# EAGLE design sequencer (EAGLE 9.6.2)
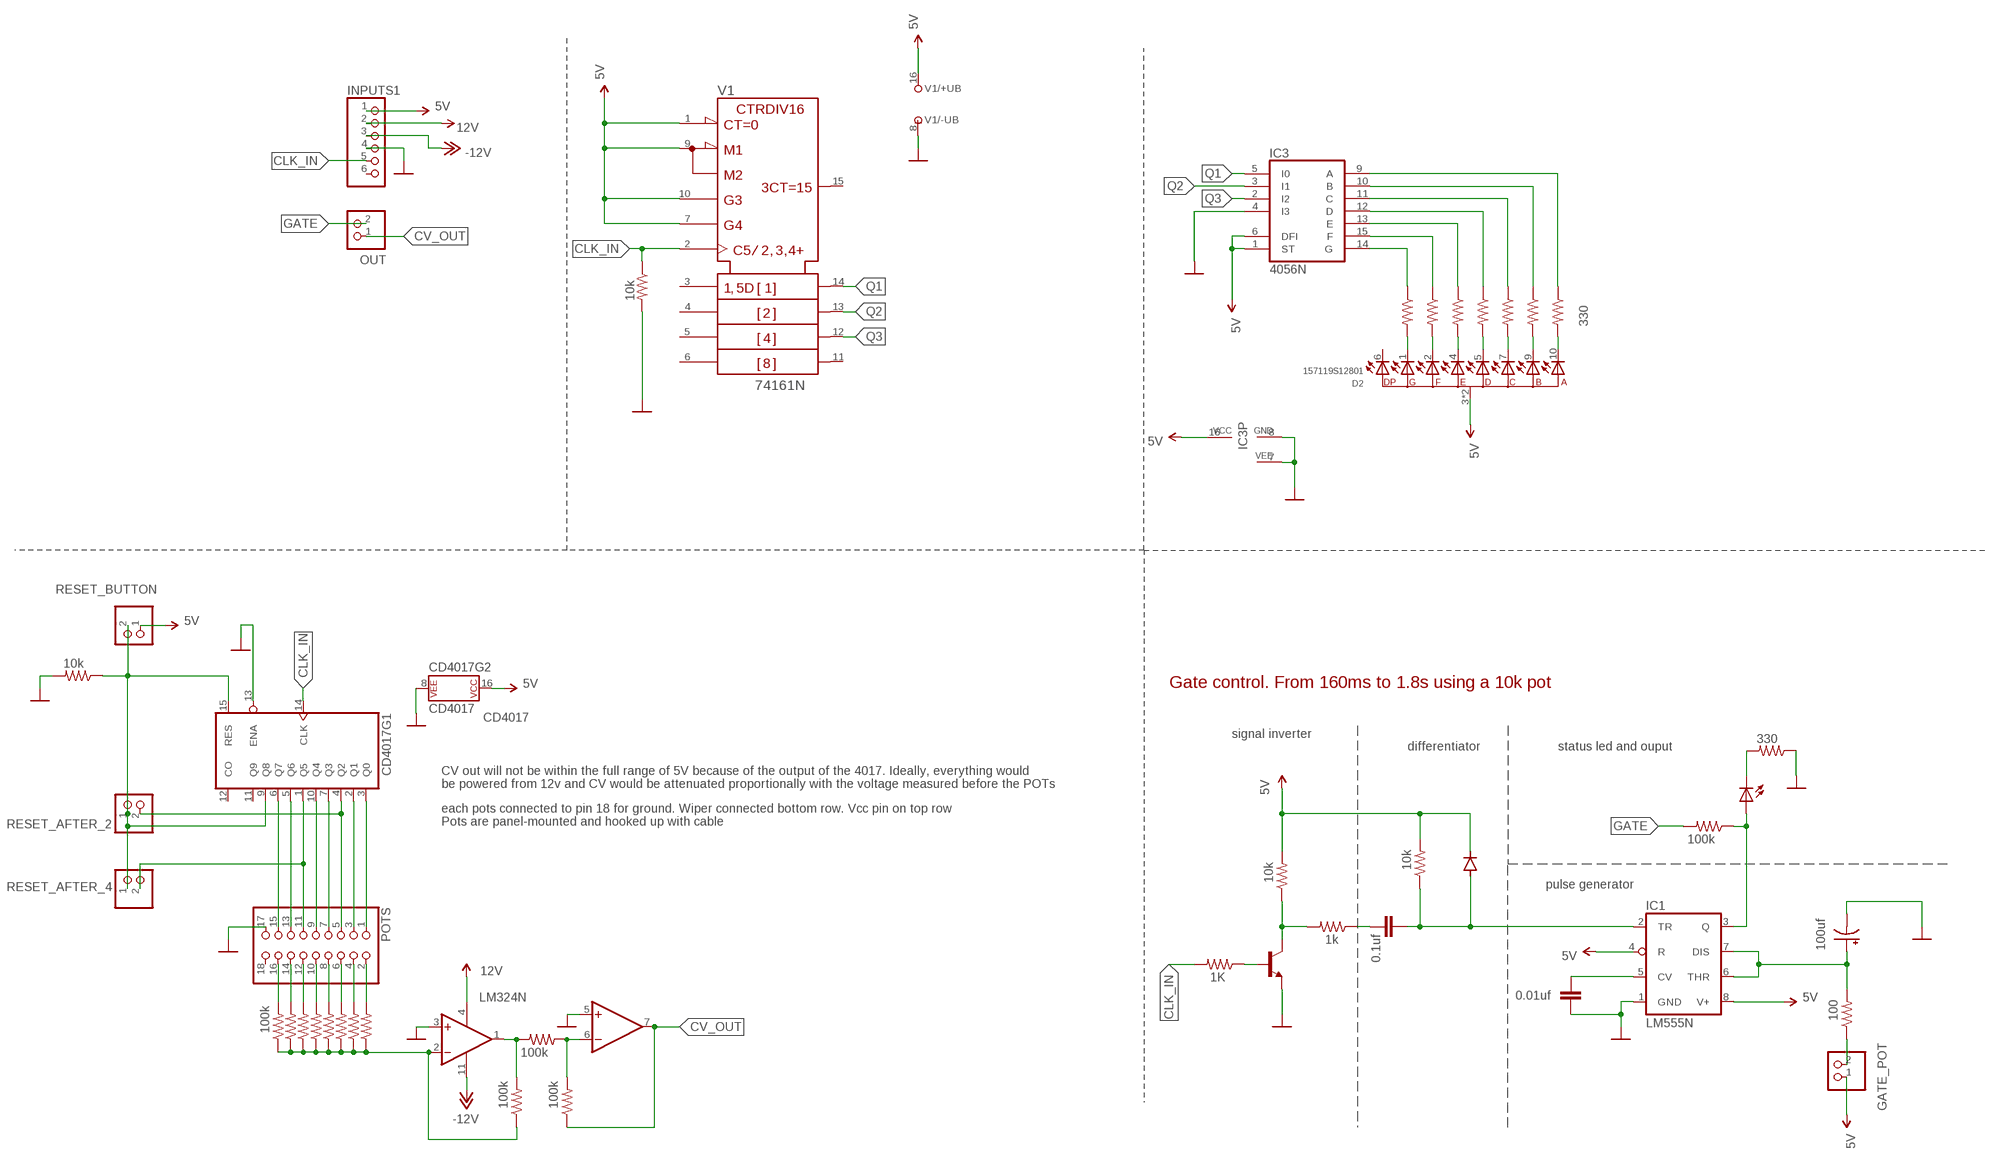
[diagram p0: schematic, sheet 1]

## Parts
1K1  100k  R-US_0207/12  [0207/12]
1K3  1k  R-US_0207/12  [0207/12]
1K4  10k  R-US_0207/12  [0207/12]
2N2  2N4401-NPN-TO92-EBC  [TO92-EBC]
C1  0.01uf  C-EU025-024X044  [C025-024X044]
C3  100uf  CPOL-USE2,5-6E  [E2,5-6E]
C4  0.1uf  C-EU025-024X044  [C025-024X044]
CD4017  CD4017  [DIP16]
D1  1N4004  [DO41-10]
D2  157119S12801  WL-T7DS_0.39INCH_COMMON-ANODE_157119S12801  [WL-T7DS_0.39INCH]
GATE_POT  PINHD-1X2  [1X02]
IC1  LM555N  [DIL08-ROUND]
IC2  LM324N  [DIL14]
IC3  4056N  [DIL16]
INPUTS1  PINHD-1X6  [1X06]
LED9  LED5MM  [LED5MM]
OUT  PINHD-1X2  [1X02]
POTS  PINHD-2X9  [2X09]
R1  330  R-US_0207/12  [0207/12]
R2  100k  R-US_0207/12  [0207/12]
R3  100k  R-US_0207/12  [0207/12]
R4  100k  R-US_0207/12  [0207/12]
R5  100k  R-US_0207/12  [0207/12]
R6  100k  R-US_0207/12  [0207/12]
R7  100k  R-US_0207/12  [0207/12]
R8  100k  R-US_0207/12  [0207/12]
R9  100k  R-US_0207/12  [0207/12]
R10  100k  R-US_0207/12  [0207/12]
R11  100k  R-US_0207/12  [0207/12]
R12  100k  R-US_0207/12  [0207/12]
R13  330  R-US_0207/12  [0207/12]
R14  330  R-US_0207/12  [0207/12]
R15  330  R-US_0207/12  [0207/12]
R16  330  R-US_0207/12  [0207/12]
R17  330  R-US_0207/12  [0207/12]
R18  330  R-US_0207/12  [0207/12]
R19  1K  R-US_0207/12  [0207/12]
R20  10k  R-US_0207/12  [0207/12]
R21  100  R-US_0207/12  [0207/12]
R22  10k  R-US_0207/12  [0207/12]
R23  330  R-US_0207/12  [0207/12]
R24  10k  R-US_0207/12  [0207/12]
RESET_AFTER_2  PINHD-1X2  [1X02]
RESET_AFTER_4  PINHD-1X2  [1X02]
RESET_BUTTON  PINHD-1X2  [1X02]
V1  74161N  [DIL16]

## Nets
5V: 1K4.2 CD4017.16(P$V+) D1.C D2.3(+) D2.8(+) GATE_POT.1 IC1.4(R) IC1.8(V+) IC3.1(ST) IC3.6(DFI) IC3.16(VCC) INPUTS1.1 R20.2 RESET_BUTTON.1 V1.1(!CLR) V1.7(ENP) V1.9(!LOAD) V1.10(ENT) V1.16(+UB)
12V: IC2.4(P:V+) INPUTS1.2
-12V: IC2.11(P:V-) INPUTS1.3
CLK_IN: CD4017.14(CLK) INPUTS1.5 R19.2 R24.1 V1.2(CLK)
CV_OUT: IC2.7(B:OUT) OUT.1 R11.1
GATE: 1K1.2 OUT.2
GND: 2N2.E C1.2 C3.- CD4017.8(P$V-) CD4017.13(ENA) IC1.1(GND) IC2.3(A:+IN) IC2.5(B:+IN) IC3.4(I3) IC3.7(VEE) IC3.8(GND) INPUTS1.4 POTS.17 R22.2 R23.1 R24.2 V1.8(-UB)
N$1: CD4017.9(Q8) CD4017.15(RES) R22.1 RESET_AFTER_2.1 RESET_AFTER_4.1 RESET_BUTTON.2
N$2: 1K3.1 C4.2
N$3: CD4017.3(Q0) POTS.1
N$4: CD4017.2(Q1) POTS.3
N$5: CD4017.4(Q2) POTS.5 RESET_AFTER_2.2
N$6: CD4017.7(Q3) POTS.7
N$7: CD4017.10(Q4) POTS.9
N$8: CD4017.1(Q5) POTS.11 RESET_AFTER_4.2
N$9: CD4017.5(Q6) POTS.13
N$10: CD4017.6(Q7) POTS.15
N$11: POTS.2 R3.2
N$12: POTS.4 R9.2
N$13: POTS.6 R8.2
N$14: POTS.8 R7.2
N$15: POTS.10 R6.2
N$16: POTS.12 R5.2
N$17: POTS.14 R4.2
N$18: POTS.16 R2.2
N$19: IC2.2(A:-IN) R2.1 R3.1 R4.1 R5.1 R6.1 R7.1 R8.1 R9.1 R10.1
N$20: IC2.1(A:OUT) R10.2 R12.2
N$21: IC2.6(B:-IN) R11.2 R12.1
N$22: IC3.15(F) R17.1
N$23: D2.1 R18.2
N$24: D2.2 R17.2
N$25: D2.4 R16.2
N$26: D2.5 R15.2
N$27: D2.7 R14.2
N$28: D2.9 R13.2
N$29: D2.10 R1.2
N$30: LED9.K(C) R23.2
N$31: GATE_POT.2 R21.1
N$32: 1K3.2 1K4.1 2N2.C
N$33: C4.1 D1.A IC1.2(TR) R20.1
N$34: C1.1 IC1.5(CV)
N$35: C3.+ IC1.6(THR) IC1.7(DIS) R21.2
N$36: 1K1.1 IC1.3(Q) LED9.A
N$37: IC3.9(A) R1.1
N$38: IC3.10(B) R13.1
N$39: IC3.11(C) R14.1
N$40: IC3.12(D) R15.1
N$41: IC3.13(E) R16.1
N$42: IC3.14(G) R18.1
N$43: 2N2.B R19.1
Q1: IC3.5(I0) V1.14(QA)
Q2: IC3.3(I1) V1.13(QB)
Q3: IC3.2(I2) V1.12(QC)
Unconnected: CD4017.11(Q9) CD4017.12(CO) D2.6 IC2.8(C:OUT) IC2.9(C:-IN) IC2.10(C:+IN) IC2.12(D:+IN) IC2.13(D:-IN) IC2.14(D:OUT) INPUTS1.6 POTS.18 V1.3(A) V1.4(B) V1.5(C) V1.6(D) V1.11(QD) V1.15(RCO)

## Notes on the sheet
- Gate control. From 160ms to 1.8s using a 10k pot
- signal inverter
- differentiator | status led and ouput
- CV out will not be within the full range of 5V because of the output of the 4017. Ideally, everything would 
  be powered from 12v and CV would be attenuated proportionally with the voltage measured before the POTs
- each pots connected to pin 18 for ground. Wiper connected bottom row. Vcc pin on top row
  Pots are panel-mounted and hooked up with cable
- pulse generator

## Library data of the parts
1K1 1K3 1K4 R1-R24 = adafruit:R-US_: RESISTOR, American symbol
2N2 = transistor-neu-to92:*-NPN-: NPN Transistror
C1 C4 = rcl:C-EU: CAPACITOR, European symbol; SPICEPREFIX: C
C3 = rcl:CPOL-US: POLARIZED CAPACITOR, American symbol; SPICEPREFIX: C
CD4017 = SparkFun-IC-Logic:CD4017: 10-Out Decade Counter Datasheet <https://cdn.sparkfun.com/datasheets/Kits/cd4022b.pdf> SparkFun Products SparkFun SparkPunk Sequencer Kit <https://www.sparkfun.com/products/12707> (KIT-12707); PROD_ID: IC-11929
D1 = diode:1N4004: DIODE general purpose rectifier, 1 A
D2 = Wurth_7 Segments Display_WL-T7DS:WL-T7DS_0.39INCH_COMMON-ANODE: WL-T7DS 7 Segments Display THT Single Digit Characteristics Industrial standard size and schematic Low power consumption Grey surface Milky / Diffuesed segments Driving with DC current in forward direction only Suitable for high peak current upto 100 mA Applications Audio / measure equipment Instrument panels Digital read out display Control units <https://www.we-online.com/catalog/media/o447285v209%20WL_T7DS_Group.jpg> Details see: https://www.we-online.com/catalog/en/WL-T7DS Created by Ella Wu, 2021-05-31 2021 (C) Wurth Elektronik; DATASHEET-URL: https://www.we-online.com/catalog/datasheet/157119S12801.pdf; EMITTING-COLOR: Super Red; HEIGHT: 7mm; IV-TYP: 38mcd; LENGTH: 13mm; PART-NUMBER: 157119S12801; VF-TYP: 2V; WIDTH: 10mm
GATE_POT OUT RESET_AFTER_2 RESET_AFTER_4 RESET_BUTTON = pinhead:PINHD-1X2: PIN HEADER
IC1 = adafruit:*555: TIMER Changed DIP package to have round (not oval) pin pads http://www.ladyada.net/library/pcb/eaglelibrary.html
IC2 = linear:LM324: OP AMP
IC3 = 40xx:4056: BCD to 7-segment LCD DECODER/DRIVER
INPUTS1 = pinhead:PINHD-1X6: PIN HEADER
LED9 = adafruit:LED: LED OSRAM: - CHIPLED LG R971, LG N971, LY N971, LG Q971, LY Q971, LO R971, LY R971 LH N974, LH R974 LS Q976, LO Q976, LY Q976 LO Q996 - Hyper CHIPLED LW Q18S LB Q993, LB Q99A, LB R99A - SideLED LS A670, LO A670, LY A670, LG A670, LP A670 LB A673, LV A673, LT A673, LW A673 LH A674 LY A675 LS A676, LA A676, LO A676, LY A676, LW A676 LS A679, LY A679, LG A679 - Hyper Micro SIDELED® LS Y876, LA Y876, LO Y876, LY Y876 LT Y87S - SmartLED LW L88C, LW L88S LB L89C, LB L89S, LG L890 LS L89K, LO L89K, LY L89K LS L896, LA L896, LO L896, LY L896 - TOPLED LS T670, LO T670, LY T670, LG T670, LP T670 LSG T670, LSP T670, LSY T670, LOP T670, LYG T670 LG T671, LOG T671, LSG T671 LB T673, LV T673, LT T673, LW T673 LH T674 LS T676, LA T676, LO T676, LY T676, LB T676, LH T676, LSB T676, LW T676 LB T67C, LV T67C, LT T67C, LS T67K, LO T67K, LY T67K, LW E67C LS E67B, LA E67B, LO E67B, LY E67B, LB E67C, LV E67C, LT E67C LW T67C LS T679, LY T679, LG T679 LS T770, LO T770, LY T770, LG T770, LP T770 LB T773, LV T773, LT T773, LW T773 LH T774 LS E675, LA E675, LY E675, LS T675 LS T776, LA T776, LO T776, LY T776, LB T776 LHGB T686 LT T68C, LB T68C - Hyper Mini TOPLED® LB M676 - Mini TOPLED Santana® LG M470 LS M47K, LO M47K, LY M47K Source: http://www.osram.convergy.de/
POTS = pinhead:PINHD-2X9: PIN HEADER
V1 = 74ttl-din:74*161: Synchrounus 4-bit COUNTER

## Board
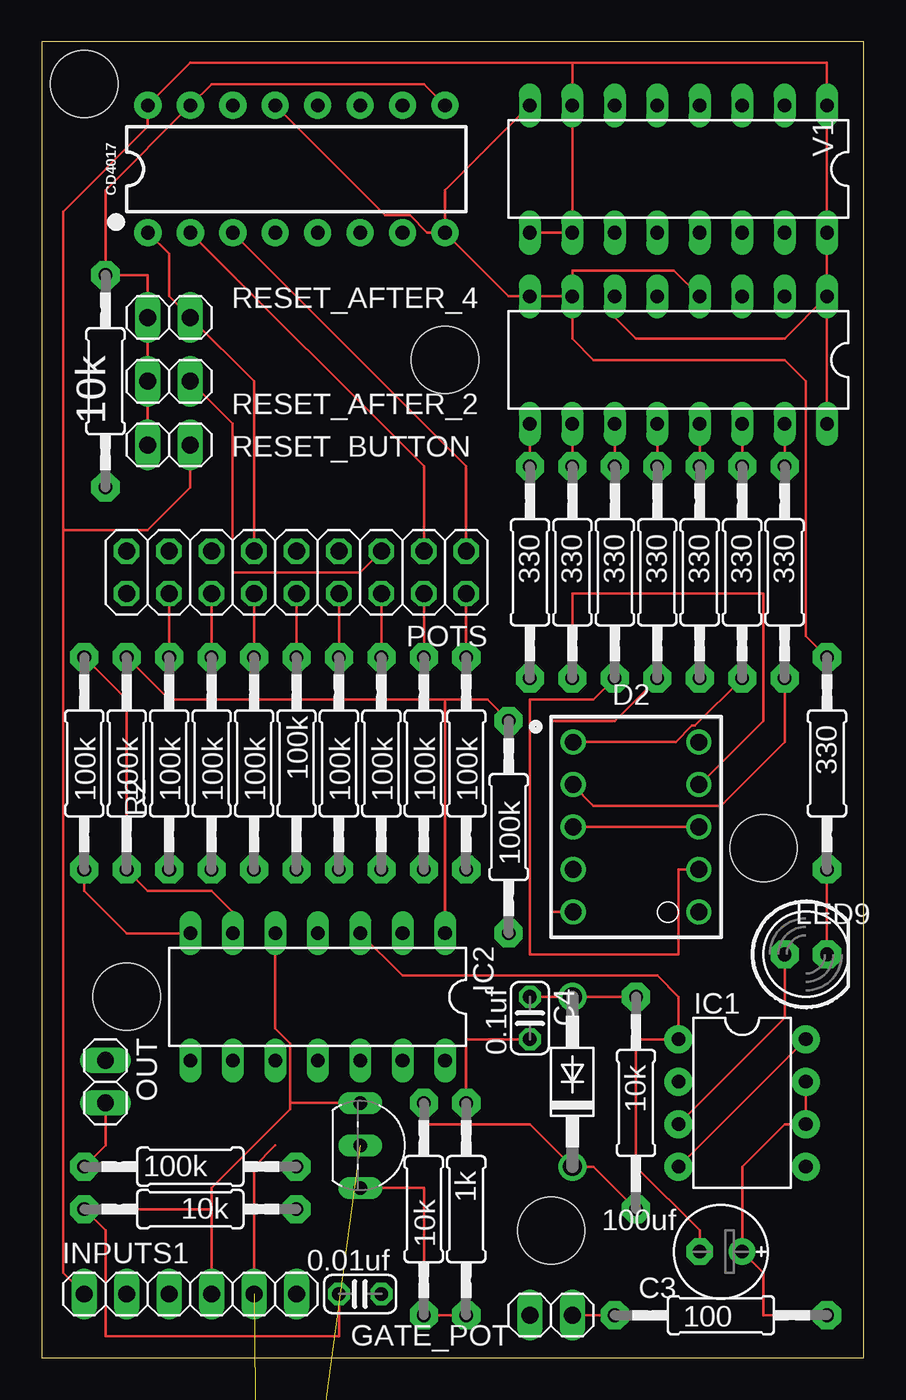
[diagram p1: board, top side]
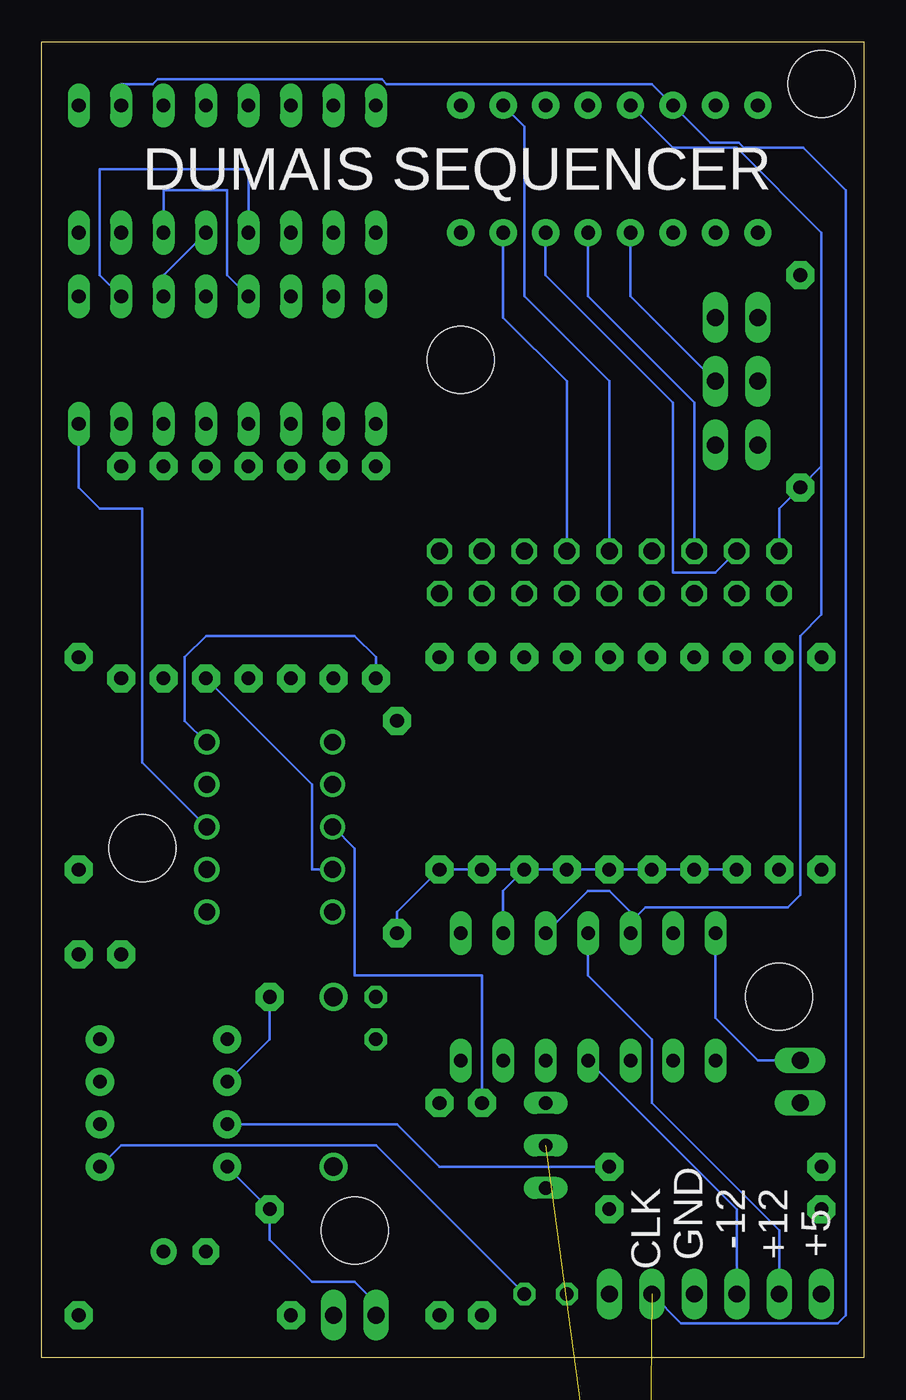
[diagram p2: board, bottom side, seen from below]

Size 49.2 x 78.73 mm. Coordinates in mm from the lower left corner, seen from the top.
Outline: 0,0 49.2,0 49.2,78.73 0,78.73 0,0
Copper layers (1*16): Top 0.035mm / dielectric 1.5mm / Bottom 0.035mm
Design rules "default": minimum track width 6mil, minimum drill 0.35mm, track to track 6mil, track to pad 6mil, pad to pad 6mil, via to via 6mil, smd to smd 6mil, copper to edge 40mil, drill to drill 6mil, minimum pad ring 10mil, minimum via ring 8mil, stop-mask expansion 4mil, vias tented up to drill 0mil, thermal gap 10mil
Holes 4 mm at 2.54,76.2 24.13,59.69 5.08,21.59 43.18,30.48 30.48,7.62

### Footprints (pad centres in the part's own frame; a part is rotated, then mirrored left to right if it is on the bottom)
0207/12 = drill 0.813 pad 1.676 octagon: 1 -6.35,0; 2 6.35,0
TO92-EBC = drill 0.813 long: B 0,-1.27; C 2.54,-1.27; E -2.54,-1.27
C025-024X044 = drill 0.813 octagon: 1 -1.27,0; 2 1.27,0
E2,5-6E = drill 0.813 pad 1.575: + -1.27,0 | drill 0.813 pad 1.575 octagon: - 1.27,0
DIP16 = drill 0.813 pad 1.626: 1 -8.89,-3.81; 2 -6.35,-3.81; 3 -3.81,-3.81; 4 -1.27,-3.81; 5 1.27,-3.81; 6 3.81,-3.81; 7 6.35,-3.81; 8 8.89,-3.81; 9 8.89,3.81; 10 6.35,3.81; 11 3.81,3.81; 12 1.27,3.81; 13 -1.27,3.81; 14 -3.81,3.81; 15 -6.35,3.81; 16 -8.89,3.81
DO41-10 = drill 1.118: A 5.08,0; C -5.08,0
WL-T7DS_0.39INCH = drill 1: 1 -3.76,5.08; 2 -3.76,2.54; 3 -3.76,0; 4 -3.76,-2.54; 5 -3.76,-5.08; 6 3.76,-5.08; 7 3.76,-2.54; 8 3.76,0; 9 3.76,2.54; 10 3.76,5.08
1X02 = drill 1.016 long: 1 -1.27,0; 2 1.27,0
DIL08-ROUND = drill 0.813 pad 1.676: 1 -3.81,-3.81; 2 -1.27,-3.81; 3 1.27,-3.81; 4 3.81,-3.81; 5 3.81,3.81; 6 1.27,3.81; 7 -1.27,3.81; 8 -3.81,3.81
DIL14 = drill 0.813 long: 1 -7.62,-3.81; 2 -5.08,-3.81; 3 -2.54,-3.81; 4 0,-3.81; 5 2.54,-3.81; 6 5.08,-3.81; 7 7.62,-3.81; 8 7.62,3.81; 9 5.08,3.81; 10 2.54,3.81; 11 0,3.81; 12 -2.54,3.81; 13 -5.08,3.81; 14 -7.62,3.81
DIL16 = drill 0.813 long: 1 -8.89,-3.81; 2 -6.35,-3.81; 3 -3.81,-3.81; 4 -1.27,-3.81; 5 1.27,-3.81; 6 3.81,-3.81; 7 6.35,-3.81; 8 8.89,-3.81; 9 8.89,3.81; 10 6.35,3.81; 11 3.81,3.81; 12 1.27,3.81; 13 -1.27,3.81; 14 -3.81,3.81; 15 -6.35,3.81; 16 -8.89,3.81
1X06 = drill 1.016 long: 1 -6.35,0; 2 -3.81,0; 3 -1.27,0; 4 1.27,0; 5 3.81,0; 6 6.35,0
LED5MM = drill 0.813 pad 1.676 octagon: A -1.27,0; K 1.27,0
2X09 = drill 1.016 octagon: 1 -10.16,-1.27; 2 -10.16,1.27; 3 -7.62,-1.27; 4 -7.62,1.27; 5 -5.08,-1.27; 6 -5.08,1.27; 7 -2.54,-1.27; 8 -2.54,1.27; 9 0,-1.27; 10 0,1.27; 11 2.54,-1.27; 12 2.54,1.27; 13 5.08,-1.27; 14 5.08,1.27; 15 7.62,-1.27; 16 7.62,1.27; 17 10.16,-1.27; 18 10.16,1.27

### Placement (x,y rotation side)
1K1  8.89,11.43 180 top
1K3  25.4,8.89 270 top
1K4  22.86,8.89 90 top
2N2  20.32,12.7 270 top
C1  19.05,3.81 180 top
C3  40.64,6.35 180 top
C4  29.21,20.32 270 top
CD4017  15.24,71.12 0 top
D1  31.75,16.51 90 top
D2  35.56,31.75 0 top
GATE_POT  30.48,2.54 0 top
IC1  41.91,15.24 270 top
IC2  16.51,21.59 180 top
IC3  38.1,59.69 180 top
INPUTS1  8.89,3.81 0 top
LED9  45.72,24.13 0 top
OUT  3.81,16.51 270 top
POTS  15.24,46.99 180 top
R1  29.21,46.99 270 top
R2  7.62,35.56 90 top
R3  25.4,35.56 90 top
R4  10.16,35.56 90 top
R5  12.7,35.56 90 top
R6  15.24,35.56 90 top
R7  17.78,35.56 90 top
R8  20.32,35.56 90 top
R9  22.86,35.56 90 top
R10  27.94,31.75 90 top
R11  2.54,35.56 90 top
R12  5.08,35.56 90 top
R13  31.75,46.99 270 top
R14  34.29,46.99 270 top
R15  36.83,46.99 270 top
R16  39.37,46.99 270 top
R17  44.45,46.99 270 top
R18  41.91,46.99 270 top
R19  7.62,-119.38 0 top  (outside the outline)
R20  35.56,15.24 270 top
R21  40.64,2.54 0 top
R22  3.81,58.42 270 top
R23  46.99,35.56 270 top
R24  8.89,8.89 180 top
RESET_AFTER_2  7.62,58.42 0 top
RESET_AFTER_4  7.62,62.23 0 top
RESET_BUTTON  7.62,54.61 180 top
V1  38.1,71.12 180 top

### Tracks (layer width: path | path; a pad name or v marks a point on that pad's centre or on a via)
5V
  Top 0.152: INPUTS1.1 1.27,5.08 1.27,49.53 | 1.27,49.53 1.27,68.58 6.35,73.66 CD4017.16 8.89,77.47 31.75,77.47 | V1.9 V1.10 V1.7 31.75,77.47 | 31.75,77.47 46.99,77.47 V1.1 V1.16 IC3.1 | D2.3 D2.8 | IC3.1 44.45,60.96 35.56,60.96 34.29,62.23 IC3.6 | IC3.1 IC3.16 | 1K4.2 22.86,13.97 29.21,13.97 D1.C 33.02,11.43 R20.2 | IC1.8 IC1.4 | RESET_BUTTON.1 8.89,52.07 6.35,49.53 1.27,49.53
  Bottom 0.152: 1K4.2 22.86,22.86 30.48,22.86 30.48,30.48 31.75,31.75 D2.3 | D2.8 43.18,35.61 43.18,50.8 45.72,50.8 46.99,52.07 IC3.16 | GATE_POT.1 29.21,3.26 30.48,4.53 33.03,4.53 35.56,7.06 R20.2 IC1.4
12V
  Bottom 0.152: INPUTS1.2 5.08,7.62 12.7,15.24 12.7,19.05 16.51,22.86 IC2.4
-12V
  Bottom 0.152: IC2.11 7.62,8.89 INPUTS1.3
CLK_IN  (1 unrouted)
  Top 0.152: 13.97,12.7 12.7,11.43 INPUTS1.5 12.7,8.89 R24.1
  Bottom 0.152: V1.2 44.45,76.2 42.56,76.2 42.28,76.48 28.84,76.48 28.56,76.2 12.7,76.2 CD4017.14 9.2,72.69 7.49,72.69 7.19,72.39 3.63,72.39 1.09,69.85 1.09,2.54 1.58,2.06 10.95,2.06 INPUTS1.5
CV_OUT
  Top 0.152: R11.1 2.54,27.94 5.08,25.4 IC2.7
  Bottom 0.152: IC2.7 8.89,20.32 6.35,17.78 OUT.1
GATE
  Top 0.152: OUT.2 3.81,12.7 1K1.2
GND
  Top 0.152: CD4017.13 20.55,68.35 22.02,68.35 23.06,67.31 CD4017.8 | IC2.5 13.97,19.7 14.86,18.81 14.86,15.24 | 14.86,15.24 14.86,14.86 10.16,10.16 INPUTS1.4 10.16,8.89 R24.2 3.81,7.62 3.81,1.27 17.78,1.27 C1.2 | V1.8 24.13,69.85 CD4017.8 | IC3.7 IC3.8 27.94,63.5 CD4017.8 | IC3.7 31.75,65.05 37.82,65.05 IC3.4 | 2N2.E 14.86,15.24 | R23.1 45.72,43.18 45.72,58.42 44.45,59.69 33.02,59.69 31.75,60.96 IC3.7 | IC2.3 21.59,22.86 36.83,22.86 38.1,21.59 IC1.1 35.56,19.05 35.56,11.43 39.37,7.62 C3.-
  Bottom 0.152: CD4017.13 11.43,72.39 7.62,72.39 2.54,67.31 2.54,53.34 | 2.54,53.34 R22.2 5.08,50.8 POTS.17 | IC2.3 16.51,27.94 15.24,27.94 13.97,26.67 IC2.5 13.97,26.05 13.07,26.95 4.56,26.95 3.81,27.7 3.81,43.18 2.54,44.45 2.54,53.34
N$1
  Top 0.152: CD4017.9 22.86,76.2 10.16,76.2 CD4017.15 3.81,69.85 R22.1 6.35,64.77 RESET_AFTER_4.1 RESET_AFTER_2.1 RESET_BUTTON.2
N$2
  Top 0.152: C4.2 25.4,19.05 1K3.1
N$3
  Top 0.152: CD4017.3 25.4,53.34 POTS.1
N$4
  Top 0.152: CD4017.2 22.86,53.34 POTS.3
N$5
  Top 0.152: RESET_AFTER_2.2 11.43,55.88 11.43,46.99 19.05,46.99 POTS.5
  Bottom 0.152: CD4017.4 13.97,63.5 RESET_AFTER_2.2
N$6
  Bottom 0.152: CD4017.7 21.59,62.23 17.78,58.42 POTS.7
N$7
  Bottom 0.152: POTS.9 15.24,58.42 20.32,63.5 20.32,73.66 CD4017.10
N$8
  Top 0.152: CD4017.1 7.62,66.04 7.62,63.5 RESET_AFTER_4.2 12.7,58.42 POTS.11
N$9
  Bottom 0.152: CD4017.5 16.51,63.5 10.16,57.15 POTS.13
N$10
  Bottom 0.152: CD4017.6 19.05,64.77 11.43,57.15 11.43,46.99 8.89,46.99 POTS.15
N$11
  Top 0.152: R3.2 POTS.2
N$12
  Top 0.152: POTS.4 R9.2
N$13
  Top 0.152: R8.2 POTS.6
N$14
  Top 0.152: POTS.8 R7.2
N$15
  Top 0.152: R6.2 POTS.10
N$16
  Top 0.152: POTS.12 R5.2
N$17
  Top 0.152: R4.2 POTS.14
N$18
  Top 0.152: POTS.16 R2.2
N$19
  Bottom 0.152: R8.1 R9.1 R3.1 27.94,26.67 R10.1 | R8.1 R7.1 R6.1 R5.1 R4.1 R2.1 | IC2.2 21.59,27.94 R8.1
N$20
  Top 0.152: R12.2 7.62,39.37 24.13,39.37 | 24.13,39.37 IC2.1 | 24.13,39.37 26.67,39.37 R10.2
N$21
  Top 0.152: R11.2 5.08,39.37 R12.1 6.35,27.94 10.16,27.94 11.43,26.67 IC2.6
N$22
  Top 0.152: IC3.15 R17.1
N$23
  Top 0.152: R18.2 39.08,37.81 38.91,37.81 37.93,36.83 D2.1
N$24
  Top 0.152: R17.2 44.45,36.83 40.64,33.02 33.02,33.02 31.75,34.29 D2.2
N$25
  Bottom 0.152: D2.4 33.02,29.21 33.02,34.29 R16.2
N$26
  Top 0.152: R15.2 34.29,38.1 30.48,38.1 30.48,26.67 D2.5
N$27
  Top 0.152: R14.2 33.02,39.37 29.21,39.37 29.21,24.13 38.1,24.13 38.1,29.21 D2.7
N$28
  Top 0.152: R13.2 31.75,45.72 43.18,45.72 43.18,38.1 39.37,34.29 D2.9
N$29
  Bottom 0.152: R1.2 29.21,41.91 30.48,43.18 39.37,43.18 40.64,41.91 40.64,38.1 39.37,36.83 D2.10
N$30
  Top 0.152: R23.2 LED9.K
N$31
  Top 0.152: GATE_POT.2 R21.1
N$32
  Top 0.152: 2N2.C 22.86,10.16 1K4.1 1K3.2
N$33
  Top 0.152: C4.1 D1.A R20.1
  Bottom 0.152: R20.1 35.56,19.05 IC1.2
N$34
  Bottom 0.152: IC1.5 44.45,12.7 29.21,12.7 C1.1
N$35
  Top 0.152: IC1.7 IC1.6 44.45,13.97 41.91,11.43 C3.+ 43.18,5.08 43.18,2.54 R21.2
N$36
  Top 0.152: LED9.A 44.45,20.32 IC1.3
  Bottom 0.152: 1K1.1 25.4,11.43 27.94,13.97 IC1.3
N$37
  Top 0.152: IC3.9 R1.1
N$38
  Top 0.152: R13.1 IC3.10
N$39
  Top 0.152: IC3.11 R14.1
N$40
  Top 0.152: R15.1 IC3.12
N$41
  Top 0.152: IC3.13 R16.1
N$42
  Top 0.152: R18.1 IC3.14
N$43  (1 unrouted)
Q1
  Bottom 0.152: V1.14 41.91,68.58 41.91,69.23 41.91,69.85 38.1,69.85 38.1,64.77 IC3.5
Q2
  Bottom 0.152: V1.13 41.91,64.77 IC3.3
Q3
  Bottom 0.152: V1.12 36.83,71.12 45.72,71.12 45.72,64.77 IC3.2

### Text on the board
bPlace: DUMAIS SEQUENCER
tNames: 10k
bNames: GND | +12 | -12 | CLK | +5